# Altium schematic sheet NTC.SchDoc: NTC
size 420 x 297 mm; SheetNumber: 8; SheetTotal: 11
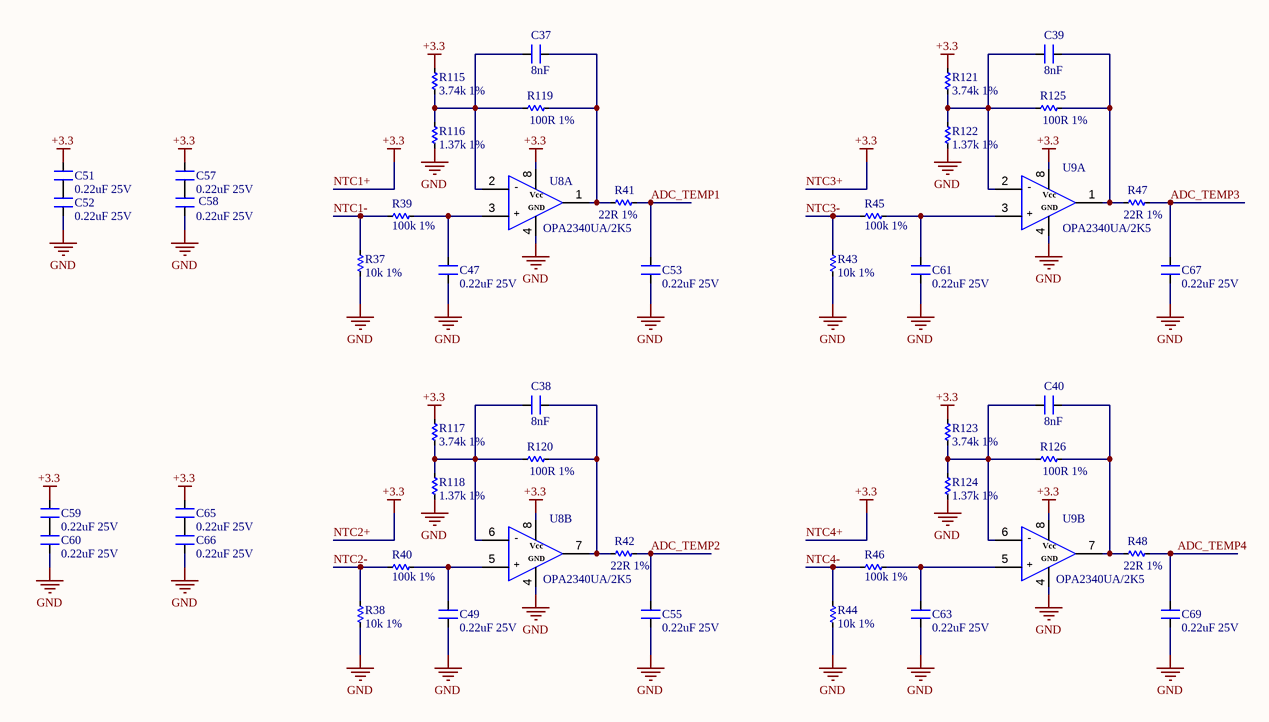
[diagram p0: NTC.SchDoc]

## Parts
C37  8nF  [CN-SMD-0603]
C38  8nF  [CN-SMD-0603]
C39  8nF  [CN-SMD-0603]
C40  8nF  [CN-SMD-0603]
C47  0.22uF 25V  [CN-SMD-0603]
C49  0.22uF 25V  [CN-SMD-0603]
C51  0.22uF 25V  [CN-SMD-0603]
C52  0.22uF 25V  [CN-SMD-0603]
C53  0.22uF 25V  [CN-SMD-0603]
C55  0.22uF 25V  [CN-SMD-0603]
C57  0.22uF 25V  [CN-SMD-0603]
C58  0.22uF 25V  [CN-SMD-0603]
C59  0.22uF 25V  [CN-SMD-0603]
C60  0.22uF 25V  [CN-SMD-0603]
C61  0.22uF 25V  [CN-SMD-0603]
C63  0.22uF 25V  [CN-SMD-0603]
C65  0.22uF 25V  [CN-SMD-0603]
C66  0.22uF 25V  [CN-SMD-0603]
C67  0.22uF 25V  [CN-SMD-0603]
C69  0.22uF 25V  [CN-SMD-0603]
R37  10k 1%  [RES-SMD-0603]
R38  10k 1%  [RES-SMD-0603]
R39  100k 1%  [RES-SMD-0603]
R40  100k 1%  [RES-SMD-0603]
R41  22R 1%  [RES-SMD-0603]
R42  22R 1%  [RES-SMD-0603]
R43  10k 1%  [RES-SMD-0603]
R44  10k 1%  [RES-SMD-0603]
R45  100k 1%  [RES-SMD-0603]
R46  100k 1%  [RES-SMD-0603]
R47  22R 1%  [RES-SMD-0603]
R48  22R 1%  [RES-SMD-0603]
R115  3.74k 1%  [RES-SMD-0603]
R116  1.37k 1%  [RES-SMD-0603]
R117  3.74k 1%  [RES-SMD-0603]
R118  1.37k 1%  [RES-SMD-0603]
R119  100R 1%  [RES-SMD-0603]
R120  100R 1%  [RES-SMD-0603]
R121  3.74k 1%  [RES-SMD-0603]
R122  1.37k 1%  [RES-SMD-0603]
R123  3.74k 1%  [RES-SMD-0603]
R124  1.37k 1%  [RES-SMD-0603]
R125  100R 1%  [RES-SMD-0603]
R126  100R 1%  [RES-SMD-0603]
U8  OPA2340UA/2K5  [SO8]  (parts A,B of 2)
U9  OPA2340UA/2K5  [SO8]  (parts A,B of 2)

## Nets
GND: C47.1 C49.1 C52.1 C53.1 C55.1 C58.1 C60.1 C61.1 C63.1 C66.1 C67.1 C69.1 R37.2 R38.2 R43.2 R44.2 R116.1 R118.1 R122.1 R124.1 U8.4 U9.4
NTC1+: C51.2 C57.2 C59.2 C65.2 R115.2 R117.2 R121.2 R123.2 U8.8 U9.8  [also labelled +3.3, NTC2+, NTC3+, NTC4+]
ADC_TEMP1: C53.2 R41.2
ADC_TEMP2: C55.2 R42.2
ADC_TEMP3: C67.2 R47.2
ADC_TEMP4: C69.2 R48.2
NTC1-: R37.1 R39.1
NTC2-: R38.1 R40.1
NTC3-: R43.1 R45.1
NTC4-: R44.1 R46.1
NetC37_1: C37.1 R41.1 R119.2 U8.1
NetC37_2: C37.2 R115.1 R116.2 R119.1 U8.2
NetC38_1: C38.1 R42.1 R120.2 U8.7
NetC38_2: C38.2 R117.1 R118.2 R120.1 U8.6
NetC39_1: C39.1 R47.1 R125.2 U9.1
NetC39_2: C39.2 R121.1 R122.2 R125.1 U9.2
NetC40_1: C40.1 R48.1 R126.2 U9.7
NetC40_2: C40.2 R123.1 R124.2 R126.1 U9.6
NetC47_2: C47.2 R39.2 U8.3
NetC49_2: C49.2 R40.2 U8.5
NetC51_1: C51.1 C52.2
NetC57_1: C57.1 C58.2
NetC59_1: C59.1 C60.2
NetC61_2: C61.2 R45.2 U9.3
NetC63_2: C63.2 R46.2 U9.5
NetC65_1: C65.1 C66.2

## Notes on the sheet
- Project:
- BEE-PC1
- Sub-system:
- NANORACK_EXP_CONTROLLER
- Design by:
- SANG HUYNH
- BAO BUI Q.
- Sheet title:
- Sheet
- A3
- of
- Checked by:
- Approved by:
- VU PHAM
- Revision:
- Document No:
- V1.0.0
- Size:
- Date:
- 01/10/2024
- (in symbol OPA2340UA/2K5, part A) -; Vcc; GND; +
- (in symbol OPA2340UA/2K5, part B) -; Vcc; GND; +

## Library data of the parts
C37-C40 C47 C49 C51-C53 C55 C57-C61 C63 C65-C67 C69 = Capacitors: Value: 33pF
R37-R48 R115-R126 = Res SMD: SMD; Manufacturer: Generic Components; Class: Passive; Published: 08/06/2000; Publisher: Altium Hobart Technology Centre